# Altium schematic sheet Servo_Outputs.SchDoc
size A4; SheetNumber: 7; SheetTotal: 7
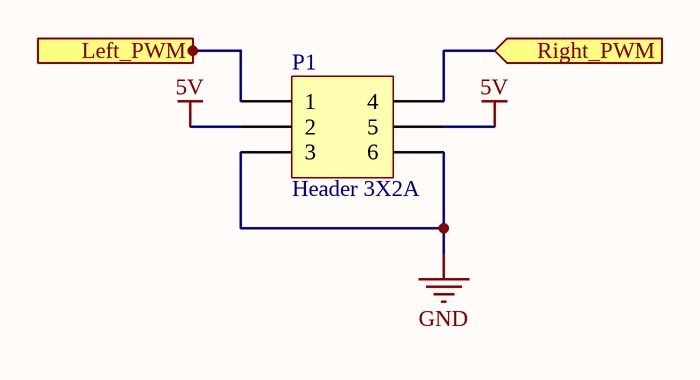
[diagram p0: Servo_Outputs.SchDoc]

## Parts
P1  Header 3X2A  [HDR2X3_CEN]

## Ports
Left_PWM (in), Right_PWM (in)

## Nets
5V: P1.2 P1.5
GND: P1.3 P1.6
Left_PWM: P1.1 ; port Left_PWM
Right_PWM: P1.4 ; port Right_PWM

## Notes on the sheet
- Author:
- Title:
- Sheet number:
- Modified:
- /
- Reviewers:
- Description:

## Library data of the parts
P1 = CMP-005-000095-1: Header, 3-Pin, Dual row; Signal Integrity: Connector; Pin Count: 6; LatestRevisionNote: Re-released for DXP Platform.; Component Type: Standard; Publisher: Altium Limited; Source: Miscellaneous Connectors.SchLib; LatestRevisionDate: 17-Jul-2002; Design Item ID: Header 3X2A